# Altium project Fly_Control.PrjPcb
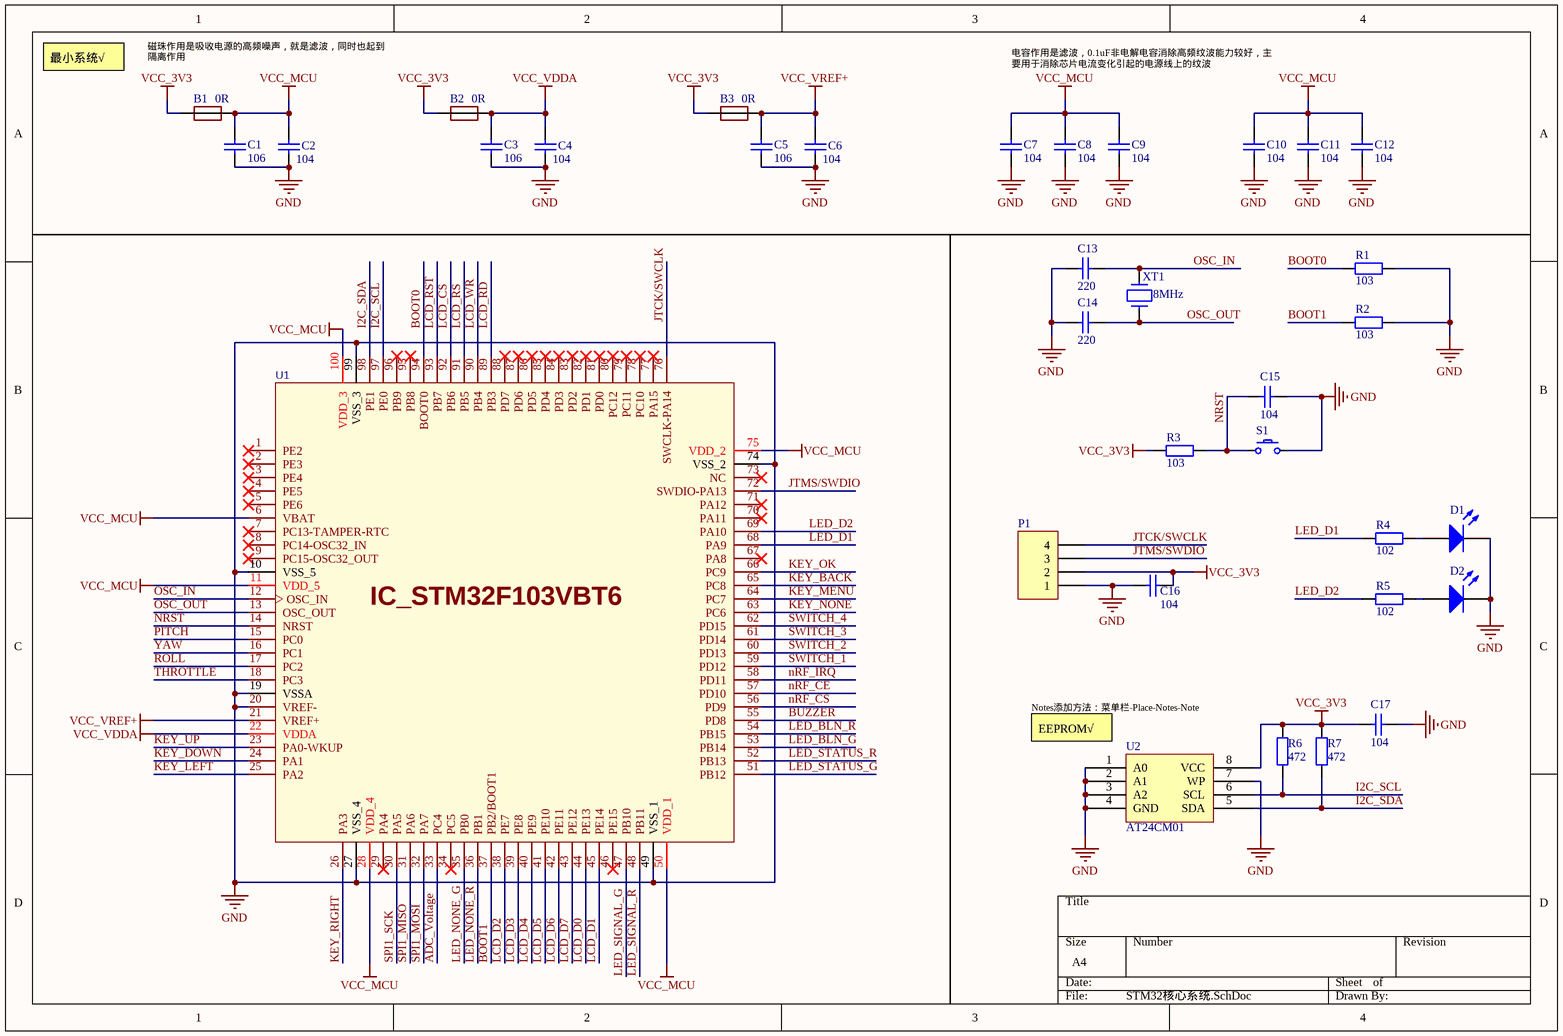
[diagram p0: STM32核心系统.SchDoc]
2 sheets, 95 parts. Net scope: global (net labels, ports and power ports of the same name join across sheets).
Board file: Fly_Control_V1.1.PcbDoc
Sheets:
  STM32核心系统.SchDoc
  基本外设.SchDoc

## Sheet STM32核心系统.SchDoc
size A4

### Parts
B1  value 0R  [CC1608-0603]  (hidden comment: MPZ1608S101ATDH5)
B2  value 0R  [CC1608-0603]  (hidden comment: MPZ1608S101ATDH5)
B3  value 0R  [CC1608-0603]  (hidden comment: MPZ1608S101ATDH5)
C1  value 106  [CC1608-0603]  (hidden comment: Cap)
C2  value 104  [CC1608-0603]  (hidden comment: Cap)
C3  value 106  [CC1608-0603]  (hidden comment: Cap)
C4  value 104  [CC1608-0603]  (hidden comment: Cap)
C5  value 106  [CC1608-0603]  (hidden comment: Cap)
C6  value 104  [CC1608-0603]  (hidden comment: Cap)
C7  value 104  [CC1608-0603]  (hidden comment: Cap)
C8  value 104  [CC1608-0603]  (hidden comment: Cap)
C9  value 104  [CC1608-0603]  (hidden comment: Cap)
C10  value 104  [CC1608-0603]  (hidden comment: Cap)
C11  value 104  [CC1608-0603]  (hidden comment: Cap)
C12  value 104  [CC1608-0603]  (hidden comment: Cap)
C13  value 220  [CC1608-0603]  (hidden comment: Cap)
C14  value 220  [CC1608-0603]  (hidden comment: Cap)
C15  value 104  [CC1608-0603]  (hidden comment: Cap)
C16  value 104  [CC1608-0603]  (hidden comment: Cap)
C17  value 104  [CC1608-0603]  (hidden comment: Cap)
D1  LED0  [CD1608-0603]  (value not drawn)
D2  LED0  [CD1608-0603]  (value not drawn)
P1  Header 4  [XHT4-2.54]  (value not drawn)
R1  value 103  [CC1608-0603]  (hidden comment: RX_RES)
R2  value 103  [CC1608-0603]  (hidden comment: RX_RES)
R3  value 103  [CC1608-0603]  (hidden comment: RX_RES)
R4  value 102  [CC1608-0603]  (hidden comment: RX_RES)
R5  value 102  [CC1608-0603]  (hidden comment: RX_RES)
R6  value 472  [CC1608-0603]  (hidden comment: RX_RES)
R7  value 472  [CC1608-0603]  (hidden comment: RX_RES)
S1  KG_SW-PB-2  [L7.3X7.3X3.2]  (value not drawn)
U1  IC_STM32F103VBT6  [LQFP-100_L14.0-W14.0-P0.50-LS16.0-BL]
U2  AT24CM01  [SO8]
XT1  value 8MHz  [OSC2-SMD_L5.0-W3.2]  (hidden comment: XT_CRYSTAL2P)

### Nets
GND: C1.1 C2.1 C3.1 C4.1 C5.1 C6.1 C7.1 C8.1 C9.1 C10.1 C11.1 C12.1 C13.2 C14.2 C15.1 C16.1 C17.1 D1.2(K) D2.2(K) P1.1 R1.2 R2.2 S1.2 U1.10(VSS_5) U1.19(VSSA) U1.20(VREF-) U1.27(VSS_4) U1.49(VSS_1) U1.74(VSS_2) U1.99(VSS_3) U2.1(A0) U2.2(A1) U2.3(A2) U2.4(GND) U2.7(WP)
VCC_3V3: B1.1 B2.1 B3.1 C16.2 C17.2 P1.2 R3.1 R6.2 R7.2 U2.8(VCC)
VCC_MCU: B1.2 C1.2 C2.2 C7.2 C8.2 C9.2 C10.2 C11.2 C12.2 U1.6(VBAT) U1.11(VDD_5) U1.28(VDD_4) U1.50(VDD_1) U1.75(VDD_2) U1.100(VDD_3)
VCC_VDDA: B2.2 C3.2 C4.2 U1.22(VDDA)
VCC_VREF+: B3.2 C5.2 C6.2 U1.21(VREF+)
ADC_Voltage: U1.33(PC4)
BOOT0: R1.1 U1.94(BOOT0)
BOOT1: R2.1 U1.37(PB2/BOOT1)
BUZZER: U1.55(PD8)
I2C_SCL: R6.1 U1.97(PE0) U2.6(SCL)
I2C_SDA: R7.1 U1.98(PE1) U2.5(SDA)
JTCK/SWCLK: P1.4 U1.76(SWCLK-PA14)
JTMS/SWDIO: P1.3 U1.72(SWDIO-PA13)
KEY_BACK: U1.65(PC8)
KEY_DOWN: U1.24(PA1)
KEY_LEFT: U1.25(PA2)
KEY_MENU: U1.64(PC7)
KEY_NONE: U1.63(PC6)
KEY_OK: U1.66(PC9)
KEY_RIGHT: U1.26(PA3)
KEY_UP: U1.23(PA0-WKUP)
LCD_CS: U1.92(PB6)
LCD_D0: U1.44(PE13)
LCD_D1: U1.45(PE14)
LCD_D2: U1.38(PE7)
LCD_D3: U1.39(PE8)
LCD_D4: U1.40(PE9)
LCD_D5: U1.41(PE10)
LCD_D6: U1.42(PE11)
LCD_D7: U1.43(PE12)
LCD_RD: U1.89(PB3)
LCD_RS: U1.91(PB5)
LCD_RST: U1.93(PB7)
LCD_WR: U1.90(PB4)
LED_BLN_G: U1.53(PB14)
LED_BLN_R: U1.54(PB15)
LED_D1: R4.1 U1.68(PA9)
LED_D2: R5.1 U1.69(PA10)
LED_NONE_G: U1.35(PB0)
LED_NONE_R: U1.36(PB1)
LED_SIGNAL_G: U1.47(PB10)
LED_SIGNAL_R: U1.48(PB11)
LED_STATUS_G: U1.51(PB12)
LED_STATUS_R: U1.52(PB13)
nRF_CE: U1.57(PD10)
nRF_CS: U1.56(PD9)
nRF_IRQ: U1.58(PD11)
NRST: C15.2 R3.2 S1.1 U1.14(NRST)
OSC_IN: C13.1 U1.12(OSC_IN) XT1.2
OSC_OUT: C14.1 U1.13(OSC_OUT) XT1.1
PITCH: U1.15(PC0)
ROLL: U1.17(PC2)
SPI1_MISO: U1.31(PA6)
SPI1_MOSI: U1.32(PA7)
SPI1_SCK: U1.30(PA5)
SWITCH_1: U1.59(PD12)
SWITCH_2: U1.60(PD13)
SWITCH_3: U1.61(PD14)
SWITCH_4: U1.62(PD15)
THROTTLE: U1.18(PC3)
YAW: U1.16(PC1)
NetD1_1: D1.1(A) R4.2
NetD2_1: D2.1(A) R5.2

Not connected (* = marked no-connect by the designer): U1 1(PE2)* 2(PE3)* 3(PE4)* 4(PE5)* 5(PE6)* 7(PC13-TAMPER-RTC)* 8(PC14-OSC32_IN)* 9(PC15-OSC32_OUT)* 29(PA4)* 34(PC5)* 46(PE15)* 67(PA8)* 70(PA11)* 71(PA12)* 73(NC)* 77(PA15)* 78(PC10)* 79(PC11)* 80(PC12)* 81(PD0)* 82(PD1)* 83(PD2)* 84(PD3)* 85(PD4)* 86(PD5)* 87(PD6)* 88(PD7)* 95(PB8)* 96(PB9)*

### Notes on the sheet
- 最小系统√
- 磁珠作用是吸收电源的高频噪声，就是滤波，同时也起到隔离作用
- 电容作用是滤波，0.1uF非电解电容消除高频纹波能力较好，主要用于消除芯片电流变化引起的电源线上的纹波
- Notes添加方法：菜单栏-Place-Notes-Note
- (near U2) EEPROM√

### Library data of the parts
B1-B3 = FB_BEAD: 磁珠
C1-C17 = Cap: Capacitor; Published: 8-Jun-2000; LatestRevisionDate: 17-Jul-2002; LatestRevisionNote: Re-released for DXP Platform.; PackageReference: RAD-0.3; Publisher: Altium Limited; PackageDescription: Radial Cap, Thru-Hole; 2 Leads; 0.3 in Pin Spacing
D1 D2 = LED0: Typical INFRARED GaAs LED; Published: 8-Jun-2000; LatestRevisionDate: 08-Jul-2005; LatestRevisionNote: Mech Layer 1 removed.; PackageReference: LED-0; Publisher: Altium Limited; PackageDescription: LED; 2 Leads
P1 = Header 4: Header, 4-Pin; LatestRevisionDate: 17-Jul-2002; LatestRevisionNote: Re-released for DXP Platform.; Publisher: Altium Limited
R1-R7 = RX_RES: 电阻
S1 = KG_SW-PB-2: 2脚开关
U1 = IC_STM32F103VBT6: STM32单片机; BOM_Manufacturer: ST; subpart_no: 2; tags: STM32; BOM_Supplier Part: C8314; BOM_Supplier: LCSC; BOM_Manufacturer Part: STM32F103VBT6; image: http://image.lceda.cn/szlcsc/C8314.jpg; spicePre: U
U2 = IC_AT24C02: 存储芯片
XT1 = XT_CRYSTAL2P: 2P晶振

## Sheet 基本外设.SchDoc
size A4
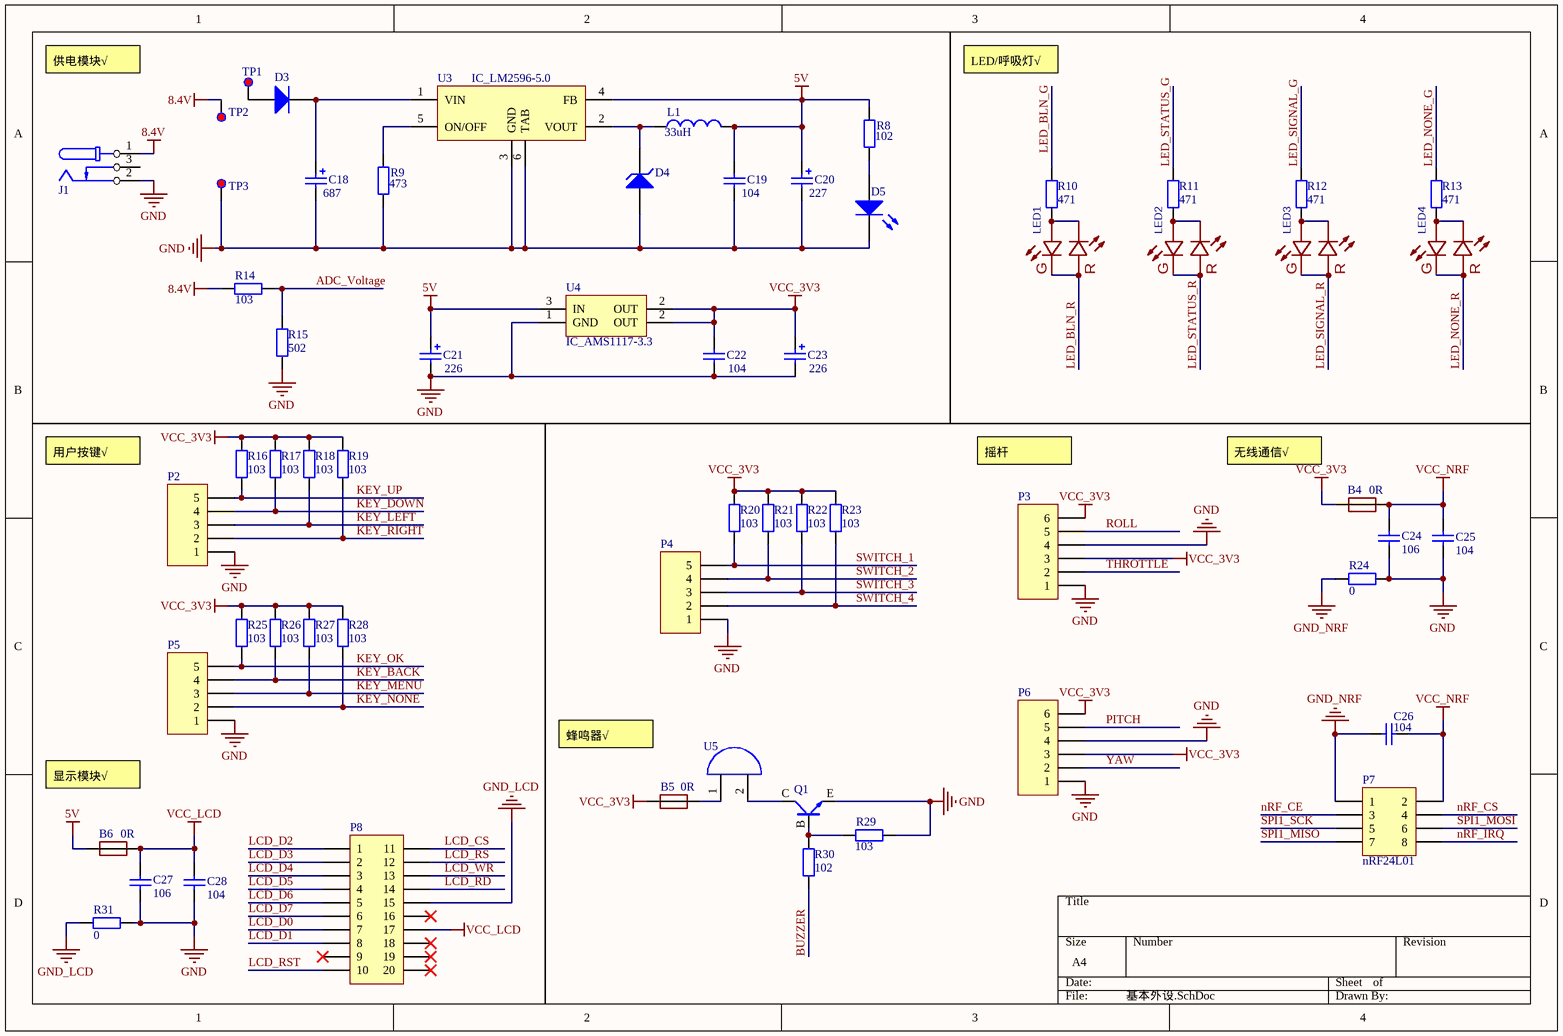
[diagram p1: 基本外设.SchDoc]

### Parts
B4  value 0R  [CC1608-0603]  (hidden comment: MPZ1608S101ATDH5)
B5  value 0R  [CC1608-0603]  (hidden comment: MPZ1608S101ATDH5)
B6  value 0R  [CC1608-0603]  (hidden comment: MPZ1608S101ATDH5)
C18  value 687  [CDT-10]  (hidden comment: Cap Pol2)
C19  value 104  [CC1608-0603]  (hidden comment: Cap)
C20  value 227  [CDT-6.3]  (hidden comment: Cap Pol2)
C21  value 226  [CDT-5]  (hidden comment: Cap Pol2)
C22  value 104  [CC1608-0603]  (hidden comment: Cap)
C23  value 226  [CDT-5]  (hidden comment: Cap Pol2)
C24  value 106  [CC1608-0603]  (hidden comment: Cap)
C25  value 104  [CC1608-0603]  (hidden comment: Cap)
C26  value 104  [CC1608-0603]  (hidden comment: Cap)
C27  value 106  [CC1608-0603]  (hidden comment: Cap)
C28  value 104  [CC1608-0603]  (hidden comment: Cap)
D3  Diode  [DO-214AC(SMA)-D]  (value not drawn)
D4  D Zener  [DO-214AC(SMA)-T]  (value not drawn)
D5  LED0  [CD1608-0603]  (value not drawn)
J1  PT_POWERJACK  [DC2.2]  (value not drawn)
L1  value 33uH  [L7.3X7.3X4.5]  (hidden comment: Inductor)
LED1  DX_LED_无极  [LED_无极]  (value not drawn)
LED2  DX_LED_无极  [LED_无极]  (value not drawn)
LED3  DX_LED_无极  [LED_无极]  (value not drawn)
LED4  DX_LED_无极  [LED_无极]  (value not drawn)
P2  Header 5  [XHT_1.25_SMD_5p]  (value not drawn)
P3  Header 6  [XHT_2.0_SMD_6P]  (value not drawn)
P4  Header 6  [XHT_1.25_SMD_5p]  (value not drawn)
P5  Header 5  [XHT_1.25_SMD_5p]  (value not drawn)
P6  Header 6  [XHT_2.0_SMD_6P]  (value not drawn)
P7  nRF24L01  [HDR2X4]
P8  Header 10X2A  [LCD_2.4_TFT]  (value not drawn)
Q1  TX_NPN  [SOT-23-3T]  (value not drawn)
R8  value 102  [CC1608-0603]  (hidden comment: Res2)
R9  value 473  [CC1608-0603]  (hidden comment: Res2)
R10  value 471  [CC1608-0603]  (hidden comment: RX_RES)
R11  value 471  [CC1608-0603]  (hidden comment: RX_RES)
R12  value 471  [CC1608-0603]  (hidden comment: RX_RES)
R13  value 471  [CC1608-0603]  (hidden comment: RX_RES)
R14  value 103  [CC1608-0603]  (hidden comment: Res2)
R15  value 502  [CC1608-0603]  (hidden comment: Res2)
R16  value 103  [CC1608-0603]  (hidden comment: RX_RES)
R17  value 103  [CC1608-0603]  (hidden comment: RX_RES)
R18  value 103  [CC1608-0603]  (hidden comment: RX_RES)
R19  value 103  [CC1608-0603]  (hidden comment: RX_RES)
R20  value 103  [CC1608-0603]  (hidden comment: RX_RES)
R21  value 103  [CC1608-0603]  (hidden comment: RX_RES)
R22  value 103  [CC1608-0603]  (hidden comment: RX_RES)
R23  value 103  [CC1608-0603]  (hidden comment: RX_RES)
R24  value 0  [CC1608-0603]  (hidden comment: RX_RES)
R25  value 103  [CC1608-0603]  (hidden comment: RX_RES)
R26  value 103  [CC1608-0603]  (hidden comment: RX_RES)
R27  value 103  [CC1608-0603]  (hidden comment: RX_RES)
R28  value 103  [CC1608-0603]  (hidden comment: RX_RES)
R29  value 103  [CC1608-0603]  (hidden comment: RX_RES)
R30  value 102  [CC1608-0603]  (hidden comment: RX_RES)
R31  value 0  [CC1608-0603]  (hidden comment: RX_RES)
TP1  PT_TESTPOINT  [TP-SMD]  (value not drawn)
TP2  PT_TESTPOINT  [TP-SMD]  (value not drawn)
TP3  PT_TESTPOINT  [TP-SMD]  (value not drawn)
U3  IC_LM2596-5.0  [TO-263-5]
U4  IC_AMS1117-3.3  [SOT-223]
U5  SC_BEEP  [SC_Buzzer]  (value not drawn)

### Nets
5V: B6.1 C19.2 C20.1 C21.1 L1.2 R8.2 U3.4(FB) U4.3(IN)
8.4V: J1.1 R14.2 TP2.1
GND: C18.2 C19.1 C20.2 C21.2 C22.1 C23.2 C24.1 C25.1 C27.1 C28.1 D4.1(A) D5.2(K) J1.2 P2.1 P3.1 P3.4 P4.1 P5.1 P6.1 P6.4 Q1.E R9.1 R15.2 R24.2 R29.1 R31.2 TP3.1 U3.3(GND) U3.6(TAB) U4.1(GND)
GND_LCD: P8.15 R31.1
GND_NRF: C26.2 P7.1 R24.1
VCC_3V3: B4.1 B5.2 C22.2 C23.1 P3.3 P3.6 P6.3 P6.6 R16.1 R17.1 R18.1 R19.1 R20.1 R21.1 R22.1 R23.1 R25.1 R26.1 R27.1 R28.1 U4.2(OUT)
VCC_LCD: B6.2 C27.2 C28.2 P8.17
VCC_NRF: B4.2 C24.2 C25.2 C26.1 P7.2
ADC_Voltage: R14.1 R15.1
BUZZER: R30.1
KEY_BACK: P5.4 R26.2
KEY_DOWN: P2.4 R17.2
KEY_LEFT: P2.3 R18.2
KEY_MENU: P5.3 R27.2
KEY_NONE: P5.2 R28.2
KEY_OK: P5.5 R25.2
KEY_RIGHT: P2.2 R19.2
KEY_UP: P2.5 R16.2
LCD_CS: P8.11
LCD_D0: P8.7
LCD_D1: P8.8
LCD_D2: P8.1
LCD_D3: P8.2
LCD_D4: P8.3
LCD_D5: P8.4
LCD_D6: P8.5
LCD_D7: P8.6
LCD_RD: P8.14
LCD_RS: P8.12
LCD_RST: P8.10
LCD_WR: P8.13
LED_BLN_G: R10.2
LED_BLN_R: LED1.1(-)
LED_NONE_G: R13.2
LED_NONE_R: LED4.1(-)
LED_SIGNAL_G: R12.2
LED_SIGNAL_R: LED3.1(-)
LED_STATUS_G: R11.2
LED_STATUS_R: LED2.1(-)
nRF_CE: P7.3
nRF_CS: P7.4
nRF_IRQ: P7.8
PITCH: P6.5
ROLL: P3.5
SPI1_MISO: P7.7
SPI1_MOSI: P7.6
SPI1_SCK: P7.5
SWITCH_1: P4.5 R20.2
SWITCH_2: P4.4 R21.2
SWITCH_3: P4.3 R22.2
SWITCH_4: P4.2 R23.2
THROTTLE: P3.2
YAW: P6.2
NetB5_1: B5.1 U5.1
NetC18_1: C18.1 D3.2(K) U3.1(VIN)
NetD3_1: D3.1(A) TP1.1
NetD4_2: D4.2(K) L1.1 U3.2(VOUT)
NetD5_1: D5.1(A) R8.1
NetLED1_2: LED1.2(+) R10.1
NetLED2_2: LED2.2(+) R11.1
NetLED3_2: LED3.2(+) R12.1
NetLED4_2: LED4.2(+) R13.1
NetQ1_B: Q1.B R29.2 R30.2
NetQ1_C: Q1.C U5.2
NetR9_2: R9.2 U3.5(ON/OFF)

Not connected (* = marked no-connect by the designer): J1 3; P8 9* 16* 18* 19* 20*

### Notes on the sheet
- 供电模块√
- LED/呼吸灯√
- 用户按键√
- 摇杆
- (near B4) 无线通信√
- 显示模块√
- 蜂鸣器√
- (in symbol DX_LED_无极) G; R
- (in symbol TX_NPN) C; E; B

### Library data of the parts
B4-B6 = FB_BEAD: 磁珠
C18 C20 C21 C23 = Cap Pol2: Polarized Capacitor (Axial); Published: 8-Jun-2000; LatestRevisionDate: 17-Jul-2002; LatestRevisionNote: Re-released for DXP Platform.; PackageReference: POLAR0.8; Publisher: Altium Limited; PackageDescription: Polarized Capacitor; 2 Leads
C19 C22 C24-C28 = Cap: Capacitor; Published: 8-Jun-2000; LatestRevisionDate: 17-Jul-2002; LatestRevisionNote: Re-released for DXP Platform.; PackageReference: RAD-0.3; Publisher: Altium Limited; PackageDescription: Radial Cap, Thru-Hole; 2 Leads; 0.3 in Pin Spacing
D3 = Diode: Default Diode; Published: 8-Jun-2000; LatestRevisionDate: 17-Jul-2002; LatestRevisionNote: Re-released for DXP Platform.; PackageVersion: Sep-1996; PackageReference: SMC; Publisher: Altium Limited; PackageDescription: DO-214-AB/SMC; 2 C-Bend Leads; Body 7.9 x 5.9 mm, inc. leads (LxW); Code_JEDEC: DO-214-AB
D4 = D Zener: Zener Diode; Published: 8-Jun-2000; LatestRevisionDate: 17-Jul-2002; LatestRevisionNote: Re-released for DXP Platform.; PackageReference: DIODE-0.7; Publisher: Altium Limited; PackageDescription: Diode, Thru-Hole; 2 Leads; 0.7 in Pin Spacing
D5 = LED0: Typical INFRARED GaAs LED; Published: 8-Jun-2000; LatestRevisionDate: 08-Jul-2005; LatestRevisionNote: Mech Layer 1 removed.; PackageReference: LED-0; Publisher: Altium Limited; PackageDescription: LED; 2 Leads
J1 = PT_POWERJACK: DC端子
L1 = Inductor: Code_IEC: 1005; Published: 8-Jun-2000; LatestRevisionDate: 29-May-2009; LatestRevisionNote: IPC-7351 Footprint Added.; PackageReference: 0402-A; Publisher: Altium Limited; PackageDescription: Chip Inductor; Code_JEITA: 0402
LED1-LED4 = DX_LED_无极: 无极双色发光二极管; BOM_Manufacturer: TOGIALED; BOM_Manufacturer Part: TJ-L5FYTXHMNPLC2R7K-A5; Contributor: LCSC; BOM_Supplier: LCSC; BOM_Supplier Part: C440436; spicePre: L; spiceSymbolName: TJ-L5FYTXHMNPLC2R7K-A5
P2 P4 P5 = Header 5: Header, 5-Pin; LatestRevisionDate: 17-Jul-2002; LatestRevisionNote: Re-released for DXP Platform.; Publisher: Altium Limited
P3 P6 = Header 6: Header, 6-Pin; LatestRevisionDate: 17-Jul-2002; LatestRevisionNote: Re-released for DXP Platform.; Publisher: Altium Limited
P7 = Header 4X2: Header, 4-Pin, Dual row; LatestRevisionDate: 17-Jul-2002; LatestRevisionNote: Re-released for DXP Platform.; Publisher: Altium Limited
P8 = Header 10X2A: Header, 10-Pin, Dual row; LatestRevisionDate: 17-Jul-2002; LatestRevisionNote: Re-released for DXP Platform.; Publisher: Altium Limited
Q1 = TX_NPN: NPN三极管
R8 R9 R14 R15 = Res2: Resistor; Published: 8-Jun-2000; LatestRevisionDate: 17-Jul-2002; LatestRevisionNote: Re-released for DXP Platform.; PackageReference: AXIAL-0.4; Publisher: Altium Limited; PackageDescription: Axial Device, Thru-Hole; 2 Leads; 0.4 in Pin Spacing
R10-R13 R16-R31 = RX_RES: 电阻
TP1-TP3 = PT_TESTPOINT: 测试点
U3 = IC_LM2596: 电源芯片
U4 = IC_AMS1117: 电源芯片
U5 = SC_BEEP: 蜂鸣器

## Nets that join several sheets
GND: STM32核心系统 (35 pins), 基本外设 (30 pins)
VCC_3V3: STM32核心系统 (10 pins), 基本外设 (21 pins)
ADC_Voltage: STM32核心系统 (U1.33), 基本外设 (R14.1 R15.1)
BUZZER: STM32核心系统 (U1.55), 基本外设 (R30.1)
KEY_BACK: STM32核心系统 (U1.65), 基本外设 (P5.4 R26.2)
KEY_DOWN: STM32核心系统 (U1.24), 基本外设 (P2.4 R17.2)
KEY_LEFT: STM32核心系统 (U1.25), 基本外设 (P2.3 R18.2)
KEY_MENU: STM32核心系统 (U1.64), 基本外设 (P5.3 R27.2)
KEY_NONE: STM32核心系统 (U1.63), 基本外设 (P5.2 R28.2)
KEY_OK: STM32核心系统 (U1.66), 基本外设 (P5.5 R25.2)
KEY_RIGHT: STM32核心系统 (U1.26), 基本外设 (P2.2 R19.2)
KEY_UP: STM32核心系统 (U1.23), 基本外设 (P2.5 R16.2)
LCD_CS: STM32核心系统 (U1.92), 基本外设 (P8.11)
LCD_D0: STM32核心系统 (U1.44), 基本外设 (P8.7)
LCD_D1: STM32核心系统 (U1.45), 基本外设 (P8.8)
LCD_D2: STM32核心系统 (U1.38), 基本外设 (P8.1)
LCD_D3: STM32核心系统 (U1.39), 基本外设 (P8.2)
LCD_D4: STM32核心系统 (U1.40), 基本外设 (P8.3)
LCD_D5: STM32核心系统 (U1.41), 基本外设 (P8.4)
LCD_D6: STM32核心系统 (U1.42), 基本外设 (P8.5)
LCD_D7: STM32核心系统 (U1.43), 基本外设 (P8.6)
LCD_RD: STM32核心系统 (U1.89), 基本外设 (P8.14)
LCD_RS: STM32核心系统 (U1.91), 基本外设 (P8.12)
LCD_RST: STM32核心系统 (U1.93), 基本外设 (P8.10)
LCD_WR: STM32核心系统 (U1.90), 基本外设 (P8.13)
LED_BLN_G: STM32核心系统 (U1.53), 基本外设 (R10.2)
LED_BLN_R: STM32核心系统 (U1.54), 基本外设 (LED1.1)
LED_NONE_G: STM32核心系统 (U1.35), 基本外设 (R13.2)
LED_NONE_R: STM32核心系统 (U1.36), 基本外设 (LED4.1)
LED_SIGNAL_G: STM32核心系统 (U1.47), 基本外设 (R12.2)
LED_SIGNAL_R: STM32核心系统 (U1.48), 基本外设 (LED3.1)
LED_STATUS_G: STM32核心系统 (U1.51), 基本外设 (R11.2)
LED_STATUS_R: STM32核心系统 (U1.52), 基本外设 (LED2.1)
nRF_CE: STM32核心系统 (U1.57), 基本外设 (P7.3)
nRF_CS: STM32核心系统 (U1.56), 基本外设 (P7.4)
nRF_IRQ: STM32核心系统 (U1.58), 基本外设 (P7.8)
PITCH: STM32核心系统 (U1.15), 基本外设 (P6.5)
ROLL: STM32核心系统 (U1.17), 基本外设 (P3.5)
SPI1_MISO: STM32核心系统 (U1.31), 基本外设 (P7.7)
SPI1_MOSI: STM32核心系统 (U1.32), 基本外设 (P7.6)
SPI1_SCK: STM32核心系统 (U1.30), 基本外设 (P7.5)
SWITCH_1: STM32核心系统 (U1.59), 基本外设 (P4.5 R20.2)
SWITCH_2: STM32核心系统 (U1.60), 基本外设 (P4.4 R21.2)
SWITCH_3: STM32核心系统 (U1.61), 基本外设 (P4.3 R22.2)
SWITCH_4: STM32核心系统 (U1.62), 基本外设 (P4.2 R23.2)
THROTTLE: STM32核心系统 (U1.18), 基本外设 (P3.2)
YAW: STM32核心系统 (U1.16), 基本外设 (P6.2)